# Altium schematic sheet subckt_adjustable_LDO.SchDoc
size A
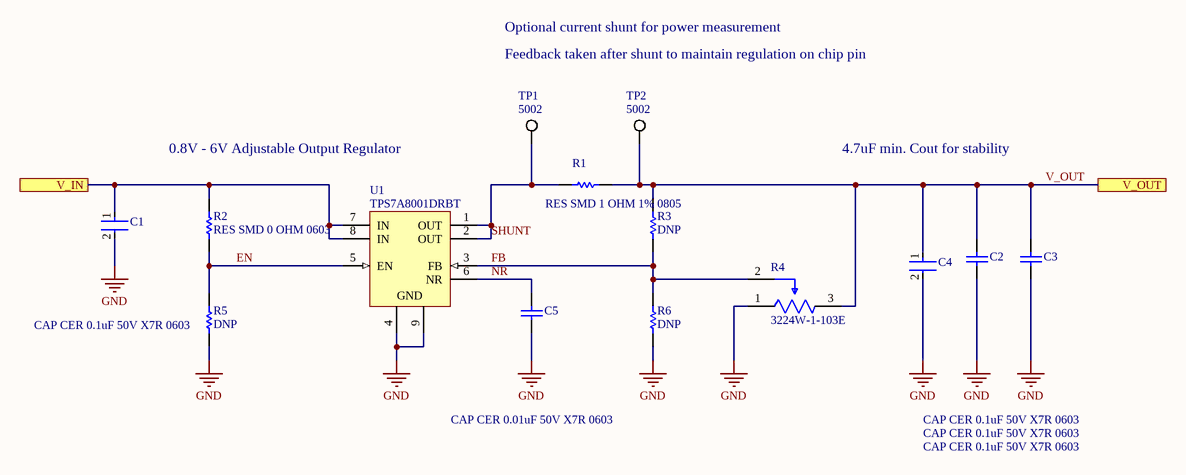
[diagram p0: subckt_adjustable_LDO.SchDoc]

## Parts
C1  CAP CER 0.1uF 50V X7R 0603  [FP-CC0603-DA-MFG]
C2  CAP CER 0.1uF 50V X7R 0603  [CAPC2013X140X50NL20T25]
C3  CAP CER 0.1uF 50V X7R 0603  [CAPC2013X140X50NL20T25]
C4  CAP CER 0.1uF 50V X7R 0603  [FP-CC0603-DA-MFG]
C5  CAP CER 0.01uF 50V X7R 0603  [CAPC1608X90X40ML10T20]
R1  RES SMD 1 OHM 1% 0805  [RESC2013X50X30NL20T20]
R2  RES SMD 0 OHM 0603  [RESC1609X50X30LL10T20]
R3  DNP  [RESC1609X50X30LL10T20]
R4  3224W-1-103E  [FP-3224W-MFG]
R5  DNP  [RESC1609X50X30LL10T20]
R6  DNP  [RESC1609X50X30LL10T20]
TP1  5002  [KSTN-5002]
TP2  5002  [KSTN-5002]
U1  TPS7A8001DRBT  [DRB0008A_V]

## Ports
V_IN, V_OUT

## Nets
GND: C1.2 C2.2 C3.2 C4.2 C5.2 R4.1(CCW) R5.1 R6.1 U1.4(GND) U1.9(GND)
EN: R2.1 R5.2 U1.5(EN)
FB: R3.1 R4.2(WIPER) R6.2 U1.3(FB)
NR: C5.1 U1.6(NR)
SHUNT: R1.1 TP1.1 U1.1(OUT) U1.2(OUT)
V_IN: C1.1 R2.2 U1.7(IN) U1.8(IN) ; port V_IN
V_OUT: C2.1 C3.1 C4.1 R1.2 R3.2 R4.3(CW) TP2.1 ; port V_OUT

## Notes on the sheet
- Optional current shunt for power measurement
- Feedback taken after shunt to maintain regulation on chip pin
- 0.8V - 6V Adjustable Output Regulator
- 4.7uF min. Cout for stability

## Library data of the parts
C1 C4 = CMP-03422-000030-1: Manufacturer Part Number: CC0603KRX7R7BB104; Manufacturer: YAGEO; Voltage Rating: 16 V; Tolerance: 0.1; Value: 100 nF; Temperature Coefficient: 15%; Material: Ceramic; Package: CC0603-DA; ComponentLink2Description: Datasheet; Octopart: https://octopart.com/cc0603krx7r7bb104-yageo-192941; Temperature Range High: +125°C; Digikey Description: CAP CER 0.1UF 16V X7R 0603; Voltage: 16 V; Device Class L2: Capacitors; Height: 0.9mm; Temperature: -55°C to +125°C; Device Class L1: Passive Components; Device Class L3: Ceramic Capacitors; ComponentLink2URL: http://www.yageo.com/documents/recent/UPY-GPHC_X7R_6.3V-to-50V_18.pdf; Footprint Url: http://www.yageo.com/exep/pages/download/literatures/UPY-C_GEN_24.pdf; RoHS: TRUE; Temperature Range Low: -55°C; Temperature Characteristic: X7R; Lead Free: Yes; Capacitance: 100 nF; Category: Cap; Mouser Description: Multilayer Ceramic Capacitor, CC Series, 0.1 - F, - 10%, X7R, 16 V, 0603 [1608 Metric]; Automotive: No
C2 C3 = CMP-2007-04677-1: Part Number: 0805ZC475KAT2A; Manufacturer: AVX Interconnect / Elco
C5 = CMP-2100-03600-1: Manufacturer: Yageo; Insulation Resistance: 100GR; Capacitance: 10nF; Tolerance: 10%; Material: Ceramic; Lead Free: LeadFree; Case/Package: 0603; Datasheet Version: Rev. 15, 10/2016; Composition: Ceramic; Radiation Hardening: No; Thickness: 0.035inch; RoHSCompliant: True; Dielectric: X7R; Voltage Rating (DC): 50V; Termination: SMD/SMT; Manufacturer URL: http://www.yageo.com/; REACH SVHC: NoSVHC; Voltage: 50V; Max Operating Temperature: 125degC; Case Code (Metric): 1608; Package Quantity: 1; Case Code (Imperial): 0603; Packaging: TapeandReel; Package Reference: 0603; Width: 0.031inch; Datasheet URL: http://www.yageo.com/documents/recent/UPY-GPHC_X7R_6.3V-to-50V_15.pdf; Length: 1.6mm; Min Operating Temperature: -55degC; Number of Pins: 2; Depth: 0.8mm; Mount: SurfaceMount; Height: 0.8mm; Voltage Rating: 50V; Package Description: 2-Pin Surface Mount Device, Body 1.6 x 0.8 mm
R1 = CMP-2001-04897-1: Manufacturer: Vishay Dale; Part Number: CRCW08050000Z0EB
R2 R3 R5 R6 = CMP-2000-03820-1: Part Number: CRCW0603100KFKEA; Manufacturer: Vishay Dale
R4 = CMP-07234-000002-1: TRIMMER 10K OHM 0.25W J LEAD TOP; Manufacturer: Bourns; Tolerance: 10%; Resistance: 10kΩ; Temperature Coefficient: 100ppm/°C; Value: 10kΩ; Standoff Height: 0.2mm; Voltage Rating: 300V; Power Rating: 250mW; Device Class L3: Variable Resistors and Potentiometers; Composition: Cermet; Temperature Range Low: -65°C; Package: 3224W; ComponentLink2Description: Datasheet; Digikey Description: TRIMMER 10K OHM 0.25W J LEAD TOP; Category: Res; Mouser Description: Trimmer Resistors - SMD 4mm 10Kohms 10% Square Cermet Sealed; Temperature: -65°C to +150°C; Device Class L2: Resistors; Device Class L1: Passive Components; RoHS: TRUE; Temperature Range High: +150°C; Manufacturer Part Number: 3224W-1-103E; ComponentLink2URL: https://upverter.com/datasheet/a166fca85da25564670351d2dc712345c058bc40.pdf; Series: 3224; Height: 5.55mm; Lead Free: Yes; Octopart: https://octopart.com/3224w-1-103e-bourns-14818; Automotive: No
TP1 TP2 = CMP-2000-05182-1: Test Point, White, 1-Pin THD, RoHS, Bulk; Manufacturer: KeystoneElectronics; Outside Diameter: 2.54mm; Plating: Silver; Mounting Hole Size: 1mm; Product: TestPoints; Packaging: Bulk; Manufacturer URL: http://www.keyelco.com/; Length: 7.62mm; Datasheet Version: Rev. G, 12/2008; Type: Miniature; Product Category: CircuitBoardHardware-PCB; Material: Nylon; RoHS: True; Contact Material: PhosphorBronze; Datasheet URL: https://ciiva.com/datasheet-click-2917627?src=ciiva&sig=bd195616; Color: White; Brand: KeystoneElectronics
U1 = CMP-0395-00597-2: Single Output LDO, 1 A, Adjustable 0.8 to 6 V Output, 2.2 to 6.5 V Input, with High-Bandwidth PSRR, 8-pin SON (DRB), -40 to 125 degC, Green (RoHS & no Sb/Br); Manufacturer: Texas Instruments; Vin(Min)(V): 2.2; Iq(Typ)(mA): 0.04; Vout Adj(Max)(V): 6; SubFamily: Single Channel LDO; Accuracy(%): 3; Vin(Max)(V): 6.5; Vdo(Typ)(mV): 170; Vout Adj(Min)(V): 0.8; Iout(Max)(A): 1; PackageReference: DRB0008A; ComponentLink3URL: http://www.ti.com/litv/pdf/mpds118h; Eco-Plan: Green (RoHS & no Sb/Br); ComponentLink2Description: Datasheet; PackageVersion: 4203482-2/K; PackageDescription: 8-Pin Plastic Small Outline, Body 3 x 3 mm, Pitch 0.65 mm; ComponentLink2URL: http://www.ti.com/general/docs/lit/getliterature.tsp?genericPartNumber=TPS7A8001&fileType=pdf; ComponentLink1Description: Manufacturer URL; DatasheetVersion: SBVS135G; ComponentLink1URL: http://www.ti.com/; Mounting Technology: Surface Mount; PartNumber: TPS7A8001DRBT; ComponentLink3Description: Package Specification